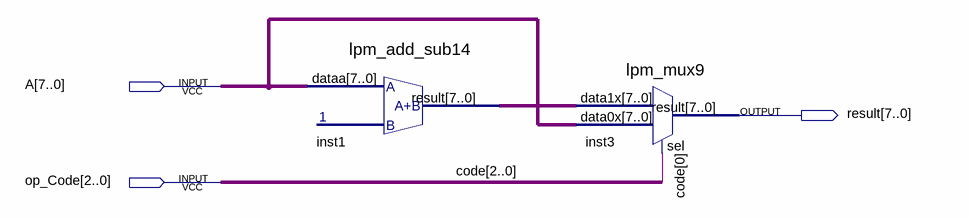
[diagram p0: schematic sheet]
// Quartus schematic ADR_ALU.bdf as structural Verilog: 2 symbols, 3 pins
module ADR_ALU (
  input  [7:0] A,
  input  [2:0] op_Code,
  output [7:0] result
);

  wire [7:0] inst1_result;

  lpm_add_sub14 inst1 (.dataa(A), .result(inst1_result));
  lpm_mux9 inst3 (.data1x(inst1_result), .data0x(A), .sel(op_Code[0]), .result(result));

  // Other names for the same wires on the sheet: code[2:0] = op_Code
endmodule
